# EasyEDA Pro project FKM3.epro, board COMBINED
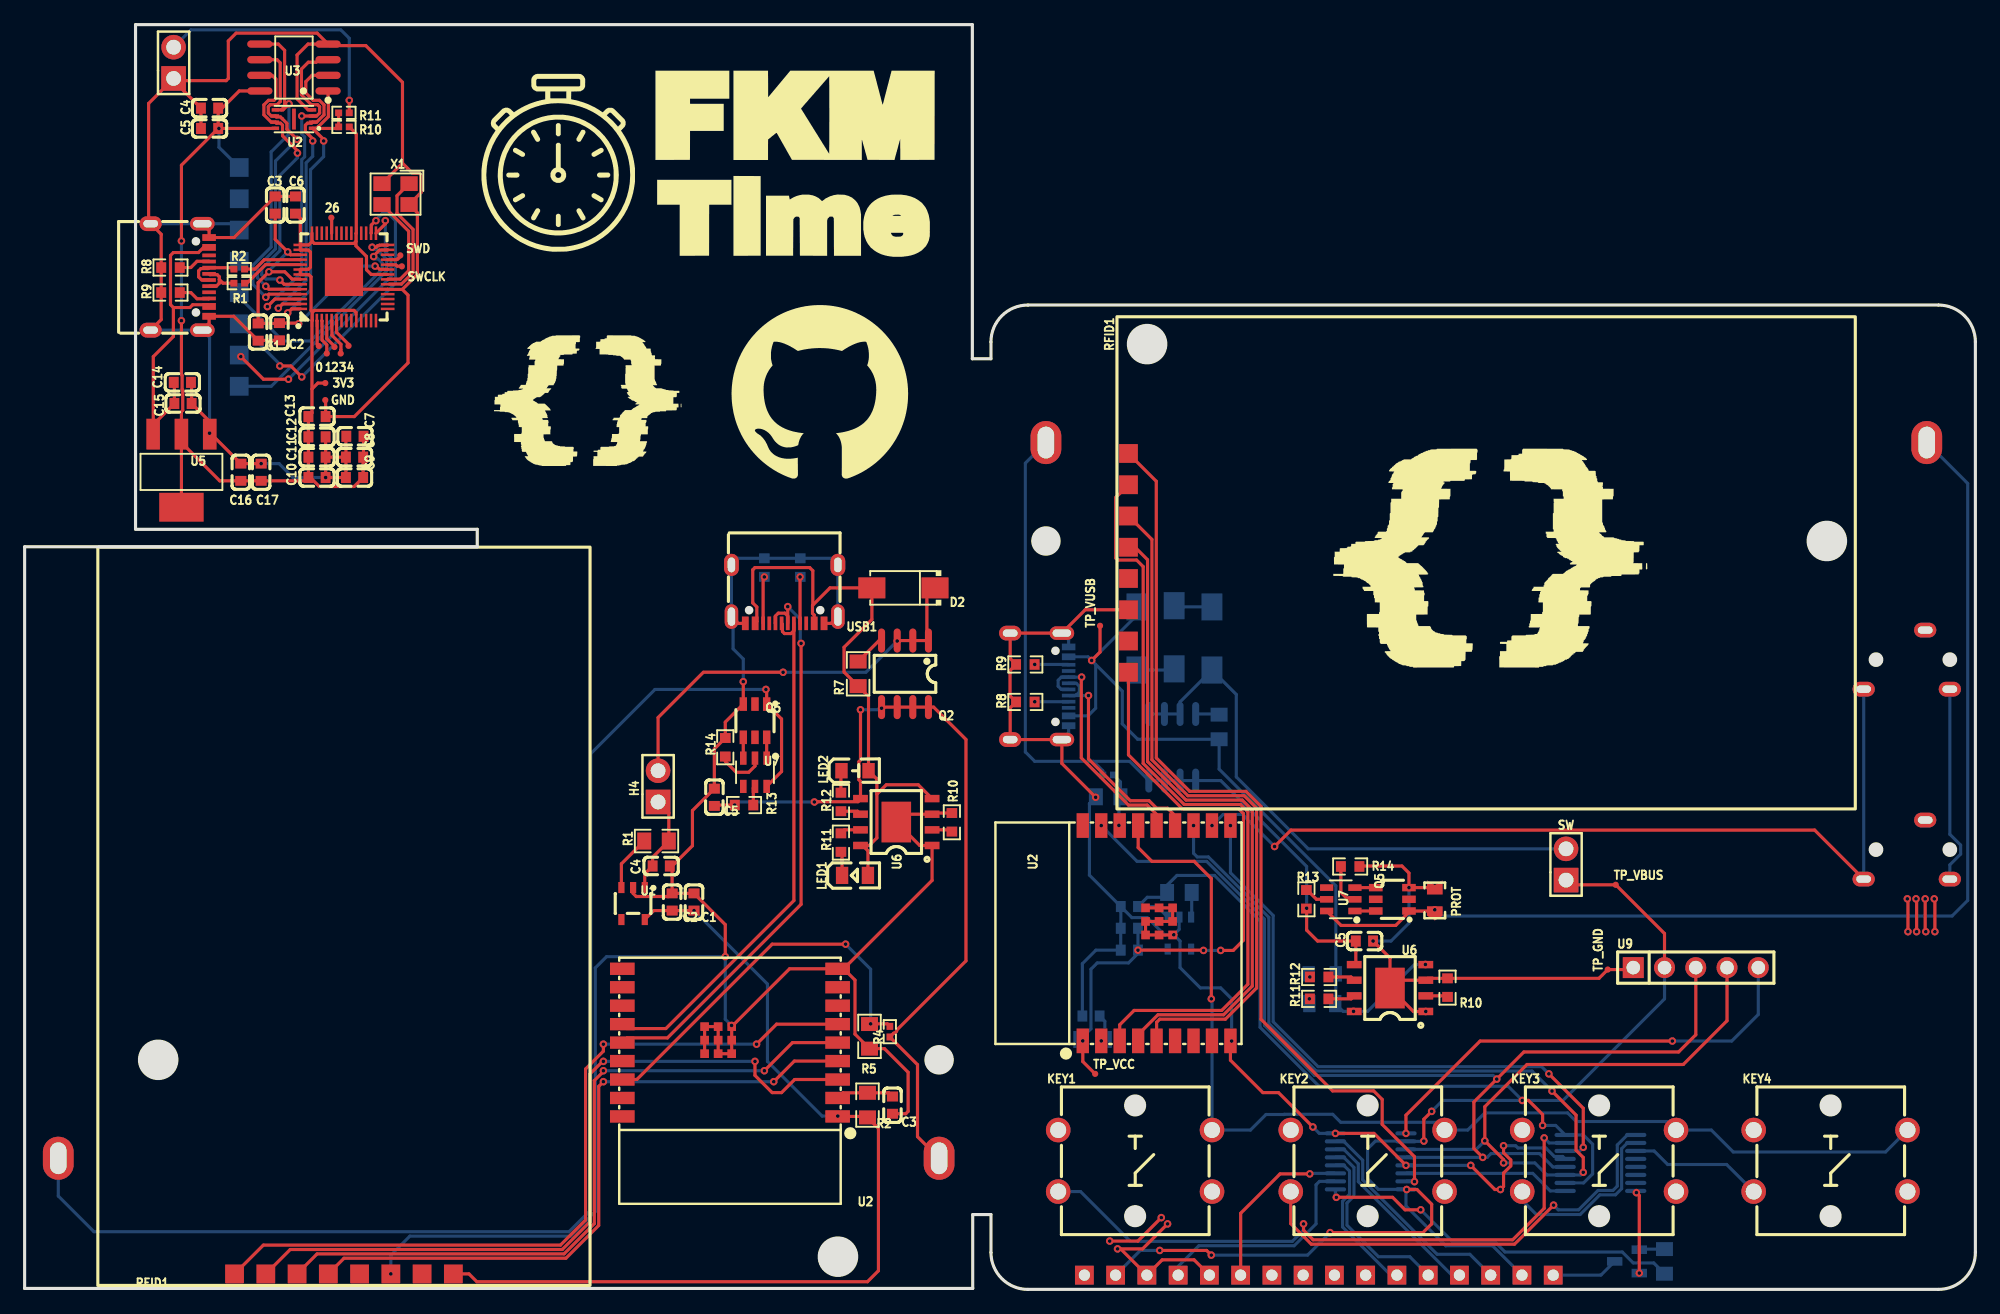
[diagram p7: board, top side]
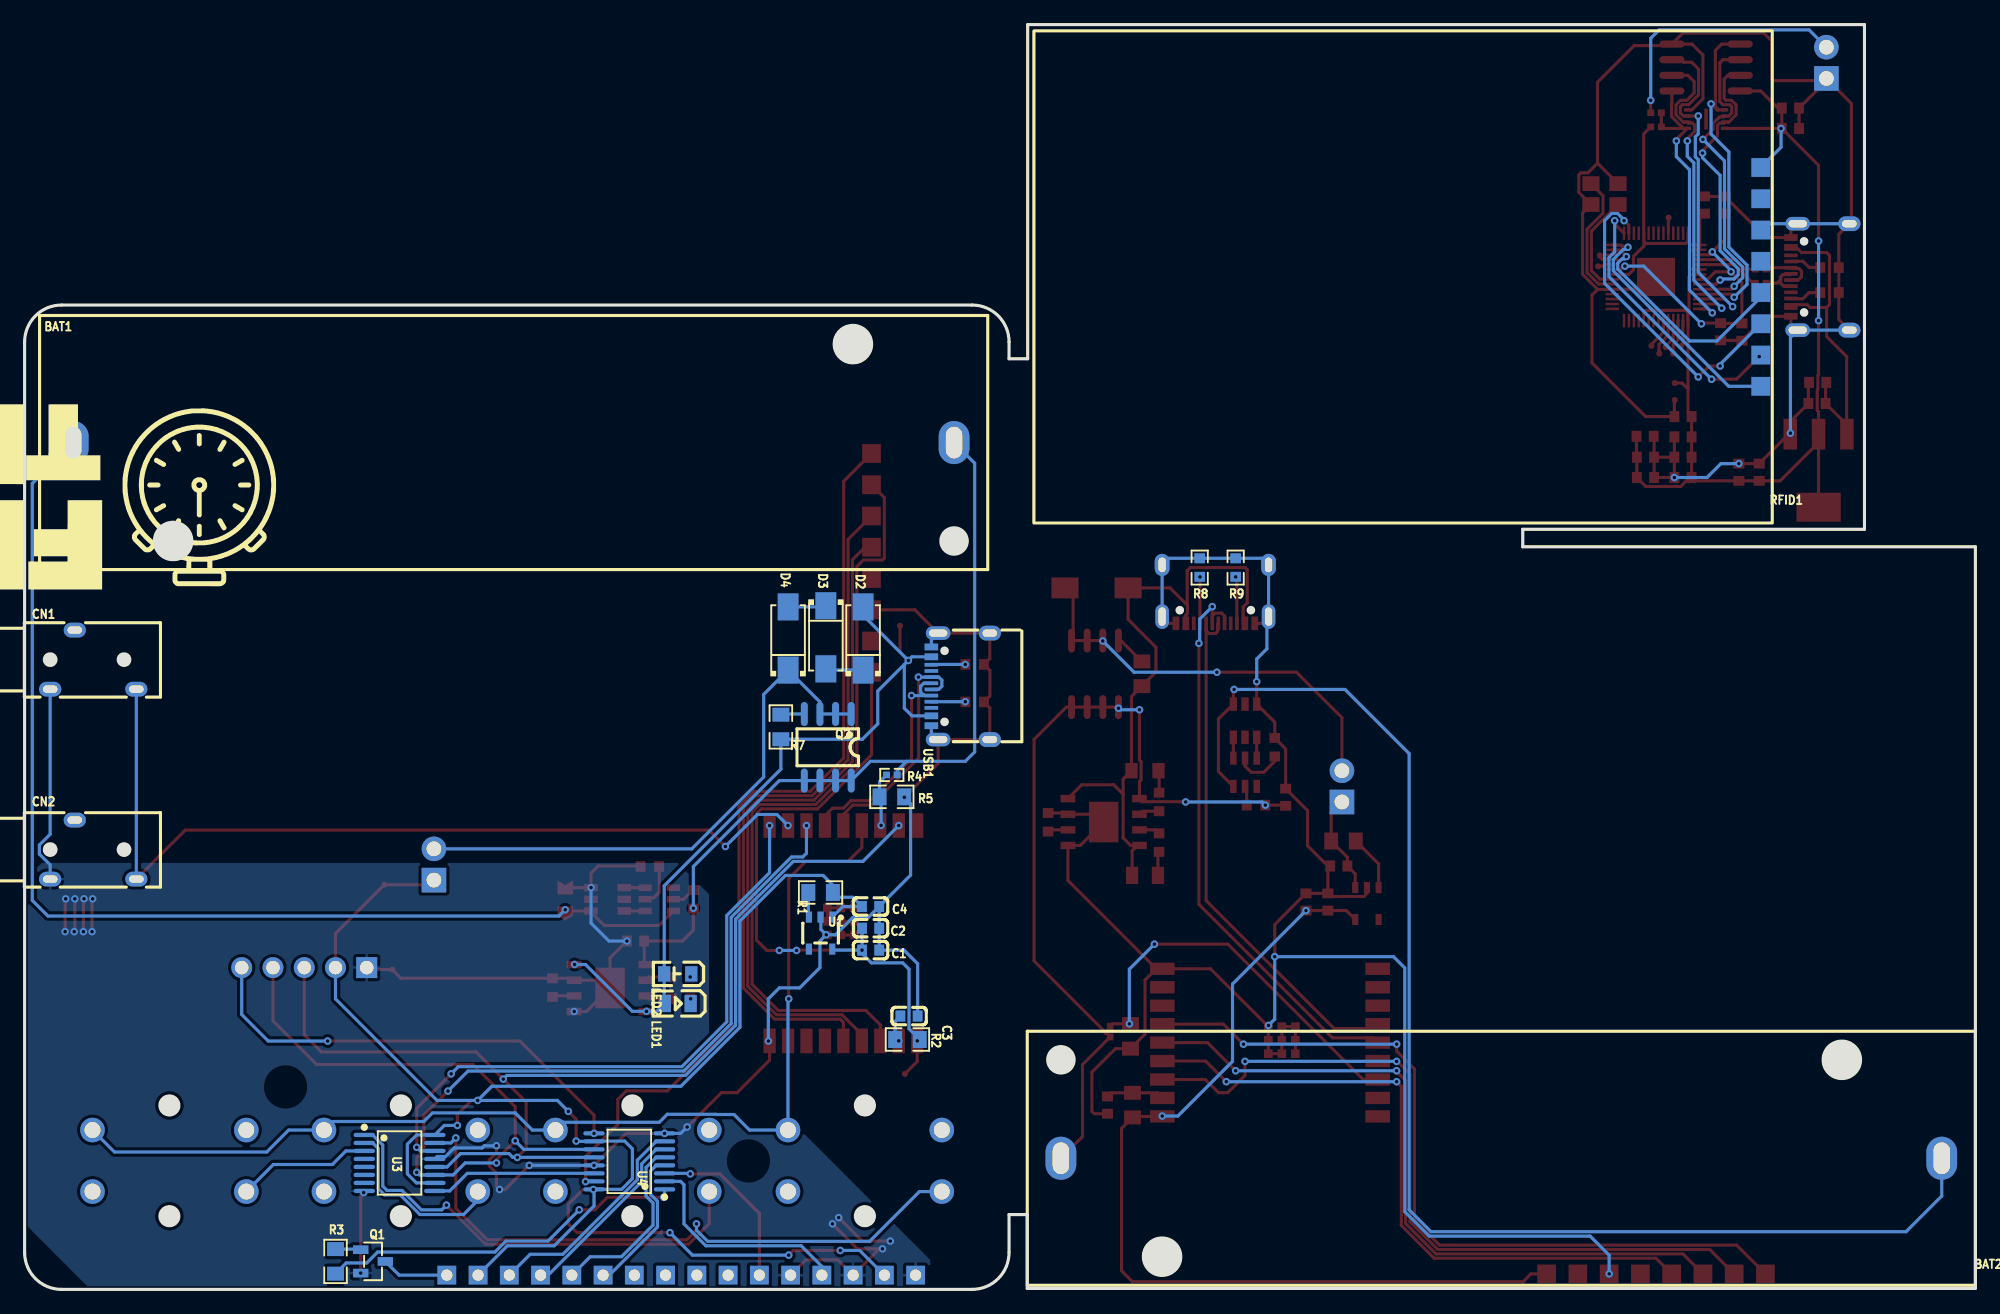
[diagram p8: board, bottom side, seen from below]

Outline 158.53 x 102.79 mm; copper layers: Top Layer, Bottom Layer. Coordinates in mm from the lower left corner of the outline.
Outline path: 0,60.35 36.78,60.35 36.78,61.78 9.01,61.78 9.01,102.79 77.02,102.79 77.02,75.63 78.53,75.63 78.53,77 arc(79.41,79.12) 81.53,80 155.53,80 arc(157.65,79.12) 158.53,77 158.53,3 arc(157.65,0.88) 155.53,0 81.53,0 arc(79.41,0.88) 78.53,3 78.53,6.08 77.05,6.08 77.05,0.08 0,0.08 0,60.35
Stack: Top Layer 0.035mm / Dielectric1 1.51mm FR4 er 4.5 / Bottom Layer 0.035mm

## Design rules (mm)
template: JLCPCB Capability(Two Layers Board)
spacing copperThickness1oz (default): track to track 0.102, other pairs 0.152 to 0.3
spacing copperThickness2oz: track to track 0.203, other pairs 0.152 to 0.3
track width copperThickness1oz (default): min 0.127, default 0.254, max 2.54
track width copperThickness2oz: min 0.203, default 0.254, max 2.54
differential pair differentialPair (default): width min 0.127, default 0.254, max 2.54; gap min 0.152, default 0.152
via viaSize (default): diameter min 0.5, default 0.61, max 10; hole min 0.3, default 0.305, max 6.3

## Placement (name value [footprint] x y rotation side)
0  -  [Test-Point-0.5mm]  23.91 76.67 0 top
1  -  [Test-Point-0.5mm]  24.55 76.06 0 top
2  -  [Test-Point-0.5mm]  25.18 76.59 0 top
3  -  [Test-Point-0.5mm]  25.69 76.06 0 top
3V3  -  [Test-Point-0.5mm]  24.43 73.66 0 top
4  -  [Test-Point-0.5mm]  26.32 76.68 0 top
26  -  [Test-Point-0.5mm]  24.92 87.1 0 top
BAT1  BH-18650-A6AJ003  [BAT-TH_BH-18650-A5BJ003]  118.79 68.82 180 bottom
BAT2  BH-18650-A6AJ003  [BAT-TH_BH-18650-A5BJ003]  38.52 10.66 0 bottom
C1  -  [C0603]  54.4 31.49 90 top
C1#2  -  [C0603]  18.98 77.8 270 top
C1#3  -  [C0603]  89.78 27.57 180 bottom
C2  -  [C0603]  52.62 31.49 90 top
C2#2  -  [C0603]  20.71 77.83 270 top
C2#3  -  [C0603]  89.78 29.35 180 bottom
C3  -  [C0603]  70.53 14.98 90 top
C3#2  -  [C0603]  20.36 88.13 90 top
C3#3  -  [C0603]  86.66 22.22 0 bottom
C4  -  [C0603]  51.73 34.41 0 top
C4#2  -  [C0603]  15.03 96 0 top
C4#3  -  [C0603]  89.78 31.12 180 bottom
C5  -  [C0603]  56.05 40 270 top
C5#2  -  [C0603]  108.88 28.31 180 top
C5#3  -  [C0603]  15.03 94.35 0 top
C6  1uF  [C0603]  22.02 88.13 270 top
C7  100nF  [C0603]  26.84 69.33 180 top
C8  100nF  [C0603]  26.81 67.63 180 top
C9  100nF  [C0603]  26.81 65.98 180 top
C10  100nF  [C0603]  23.76 65.98 0 top
C11  100nF  [C0603]  23.76 67.63 0 top
C12  100nF  [C0603]  23.76 69.28 0 top
C13  100nF  [C0603]  23.76 70.94 0 top
C14  100nF  [C0603]  12.82 73.72 180 top
C15  10uF  [C0603]  12.87 72 180 top
C16  100nF  [C0603]  17.57 66.41 270 top
C17  10uF  [C0603]  19.22 66.41 270 top
CN1  PJ-3200  [AUDIO-TH_PJ-3200]  152.95 51.18 180 bottom
CN2  PJ-3200  [AUDIO-TH_PJ-3200]  152.95 35.74 180 bottom
D2  -  [SMA_L4.2-W2.6-LS5.3-RD]  71.42 57.01 180 top
D2#2  -  [SMA_L4.2-W2.6-LS5.3-RD]  90.39 52.9 90 bottom
D3  SS14  [SMA_L4.2-W2.6-LS5.3-RD]  93.42 53 270 bottom
D4  SS14  [SMA_L4.2-W2.6-LS5.3-RD]  96.49 52.9 90 bottom
GND  -  [Test-Point-0.5mm]  24.43 72.28 0 top
H1  -  [LCD16x2 edge connector]  86.12 1.16 0 top
H1#2  -  [HDR-TH_2P-P2.54-V-M]  12.11 99.69 90 top
H4  PW SWITCH  [HDR-TH_2P-P2.54-V-M]  51.48 40.88 90 top
KEY1  B3F-4055  [KEY-TH_4P-L12.0-W12.0-P5.00-LS13.4-EH]  90.25 10.45 0 top
KEY2  B3F-4055  [KEY-TH_4P-L12.0-W12.0-P5.00-LS13.4-EH]  109.14 10.45 0 top
KEY3  B3F-4055  [KEY-TH_4P-L12.0-W12.0-P5.00-LS13.4-EH]  127.95 10.45 0 top
KEY4  B3F-4055  [KEY-TH_4P-L12.0-W12.0-P5.00-LS13.4-EH]  146.76 10.45 0 top
LED1  -  [LED0805-R-RD]  67.48 33.64 0 top
LED1#2  -  [LED0805-R-RD]  105.45 23.23 0 bottom
LED2  -  [LED0805-RD_BLUE]  67.48 42.15 0 top
LED2#2  -  [LED0805-RD_BLUE]  105.45 25.64 0 bottom
PROT  SOLDERING JUMPER  [JUMPER]  114.6 32.88 90 top
Q1  MMBT3904  [SOT-23-3_L2.9-W1.3-P1.90-LS2.4-BR]  130.22 2.28 0 bottom
Q2  -  [SOIC-8_L5.0-W4.0-P1.27-LS6.0-BL]  71.55 50.03 180 top
Q2#2  -  [SOIC-8_L5.0-W4.0-P1.27-LS6.0-BL]  93.26 44.06 0 bottom
Q5  -  [SOT-23-6_L2.9-W1.6-P0.95-LS2.8-BR]  59.35 46.22 90 top
Q5#2  -  [SOT-23-6_L2.9-W1.6-P0.95-LS2.8-BR]  111.15 31.7 0 top
R1  -  [R0402]  17.44 81.78 180 top
R1#2  -  [R0805]  51.35 36.44 0 top
R1#3  -  [R0805]  93.84 32.26 180 bottom
R2  -  [R0402]  17.44 82.92 180 top
R2#2  -  [R0805]  68.5 14.98 90 top
R2#3  -  [R0805]  86.79 20.31 0 bottom
R3  10kΩ  [R0805]  133.26 2.28 90 bottom
R4  -  [R0402]  70.31 20.94 90 top
R4#2  -  [R0402]  88.05 41.81 0 bottom
R5  -  [R0805]  68.66 20.56 270 top
R5#2  -  [R0805]  88.05 40.03 180 bottom
R7  -  [R0805]  67.73 50.03 90 top
R7#2  -  [R0805]  97.07 45.71 90 bottom
R8  -  [R0603]  81.32 47.74 0 top
R8#2  -  [R0603]  11.85 83.05 0 top
R8#3  -  [R0603]  63.04 58.66 270 bottom
R9  -  [R0603]  81.32 50.79 0 top
R9#2  -  [R0603]  11.85 81.02 0 top
R9#3  -  [R0603]  60.11 58.66 270 bottom
R10  -  [R0402]  25.95 94.48 0 top
R10#2  -  [R0603]  75.36 37.96 90 top
R10#3  -  [R0603]  115.63 24.53 90 top
R11  -  [R0402]  25.95 95.62 180 top
R11#2  -  [R0603]  66.34 36.31 90 top
R11#3  -  [R0603]  105.2 23.61 0 top
R12  -  [R0603]  66.34 39.61 270 top
R12#2  -  [R0603]  105.2 25.39 0 top
R13  -  [R0603]  58.46 39.36 180 top
R13#2  -  [R0603]  104.16 31.7 270 top
R14  -  [R0603]  56.94 44.06 270 top
R14#2  -  [R0603]  107.72 34.37 180 top
RFID1  -  [RFID-RC522-Board]  64.43 5.58 90 top
RFID1#2  -  [RFID-RC522-Board]  94.02 20.56 0 top
RFID1#3  -  [RFID-RC522-Board]  21.76 120.77 0 bottom
SW  PW SWITCH  [HDR-TH_2P-P2.54-V-M]  125.27 34.53 90 top
SWCLK  -  [Test-Point-0.5mm]  30.66 83.14 0 top
SWD  -  [Test-Point-0.5mm]  30.53 84.03 0 top
TP_GND  -  [Test-Point-0.5mm]  128.65 25.99 90 top
TP_VBUS  -  [Test-Point-0.5mm]  129.3 32.88 0 top
TP_VCC  -  [Test-Point-0.5mm]  87 17.52 0 top
TP_VUSB  -  [Test-Point-0.5mm]  87.39 53.93 90 top
U1  -  [SOT-25_L3.0-W1.6-P0.95-LS2.8-BL]  49.45 31.36 180 top
U1#2  -  [LQFN-56_L7.0-W7.0-P0.4-EP]  25.95 82.29 90 top
U1#3  -  [SOT-25_L3.0-W1.6-P0.95-LS2.8-BL]  93.84 28.96 0 bottom
U2  -  [USON-8_L3.0-W2.0-P0.50-BL-EP]  21.89 95.11 90 top
U2#2  -  [BULETM-SMD_ESPRESSIF_ESP32-C3-WROOM-02-N4-4MB]  57.32 20.06 180 top
U2#3  -  [BULETM-SMD_ESPRESSIF_ESP32-C3-WROOM-02-N4-4MB]  91.99 28.95 90 top
U3  -  [SOIC-8_L4.9-W3.9-P1.27-LS6.0-BL]  21.89 99.3 90 top
U3#2  -  [TSSOP-16_L5.0-W4.4-P0.65-LS6.4-BL]  128.06 10.28 270 bottom
U4  74HC595PW,118  [TSSOP-16_L5.0-W4.4-P0.65-LS6.4-BL]  109.39 10.4 90 bottom
U5  AMS1117-3.3  [SOT-223-3_L6.5-W3.4-P2.30-LS7.0-BR]  12.74 66.54 90 top
U6  -  [ESOP-8_L4.9-W3.9-P1.27-LS6.0-BL-EP]  70.84 37.98 90 top
U6#2  -  [ESOP-8_L4.9-W3.9-P1.27-LS6.0-BL-EP]  110.96 24.49 90 top
U7  -  [SOT-23-6_L2.9-W1.6-P0.95-LS2.8-BL]  59.35 42.03 180 top
U7#2  -  [SOT-23-6_L2.9-W1.6-P0.95-LS2.8-BL]  106.96 31.7 90 top
U9  HB-PH3-25415PB2GOP  [HDR-TH_5P-P2.54-V-M]  135.81 26.15 0 top
USB1  -  [USB-C-SMD_TYPE-C-6PIN-2MD-073]  61.77 56.51 180 top
USB1#2  -  [USB-C-SMD_TYPE-C-6PIN-2MD-073]  12.62 82.29 270 top
USB1#3  -  [USB-C-SMD_TYPE-C-6PIN-2MD-073]  82.47 49.01 90 bottom
X1  12MHz  [CRYSTAL-SMD_4P-L3.2-W2.5-BL]  30.14 89.02 180 top

## Footprints (pads in the part's own frame, mm; a bottom-side part is the same pattern mirrored in y, then rotated)
AUDIO-TH_PJ-3200
  oval 1.8x1.2 hole 1.2x0.6: 2(-1.5,2.4) 3(-3.5,-2.4) 4(3.5,-2.4)
BAT-TH_BH-18650-A5BJ003
  oval 2.5x3.5 hole 1.34x2.58: 1(-35.79,0) 2(35.79,0)
BULETM-SMD_ESPRESSIF_ESP32-C3-WROOM-02-N4-4MB
  rect 2x1 smd: 1(-8.75,6) 2(-8.75,4.5) 3(-8.75,3) 4(-8.75,1.5) 5(-8.75,0) 6(-8.75,-1.5) 7(-8.75,-3) 8(-8.75,-4.5) 9(-8.75,-6) 10(8.75,-6) 11(8.75,-4.5) 12(8.75,-3) 13(8.75,-1.5) 14(8.75,0) 15(8.75,1.5) 16(8.75,3) 17(8.75,4.5) 18(8.75,6)
  rect 0.7x0.7 smd: 19(-0.14,0.9) 19(-0.14,-0.2) 19(-0.14,-1.3) 19(0.96,0.9) 19(0.96,-0.2) 19(0.96,-1.3) 19(2.06,0.9) 19(2.06,-0.2) 19(2.06,-1.3)
C0603
  rect 0.8x0.9 smd: 1(-0.7,0) 2(0.7,0)
CRYSTAL-SMD_4P-L3.2-W2.5-BL
  rect 1.4x1.2 smd: 1(-1.1,-0.85) 2(1.1,-0.85) 3(1.1,0.85) 4(-1.1,0.85)
ESOP-8_L4.9-W3.9-P1.27-LS6.0-BL-EP
  rect 0.6x1.2 smd: 1(-1.905,-2.909) 2(-0.635,-2.909) 3(0.635,-2.909) 4(1.905,-2.909) 5(1.905,2.909) 6(0.635,2.909) 7(-0.635,2.909) 8(-1.905,2.909)
  rect 3.3x2.4 smd: 9(0,0)
HDR-TH_2P-P2.54-V-M
  rect 2x2 hole 1.2: 1(-1.27,0)
  round 2 hole 1.2: 2(1.27,0)
HDR-TH_5P-P2.54-V-M
  rect 1.7x1.7 hole 1.1: 1(-5.08,0)
  round 1.7 hole 1.1: 2(-2.54,0) 3(0,0) 4(2.54,0) 5(5.08,0)
JUMPER
  custom 1.143x1.27 smd: 1(-2.134,0) 2(-0.406,0)
KEY-TH_4P-L12.0-W12.0-P5.00-LS13.4-EH
  round 2 hole 1.3: 1(6.25,-2.5) 2(-6.25,-2.5) 3(6.25,2.5) 4(-6.25,2.5)
LCD16x2 edge connector
  rect 1.524x1.524 hole 0.914x0.914: 1(0,0) 3(5.08,0) 4(7.62,0) 5(10.16,0) 6(12.7,0) 7(15.24,0) 8(17.78,0) 9(20.32,0) 10(22.86,0) 11(25.4,0) 12(27.94,0) 13(30.48,0) 14(33.02,0) 15(35.56,0) 16(38.1,0)
  rect 1.524x1.524 hole 0.914x1: 2(2.54,0)
LED0805-R-RD
  rect 1x1.399 smd: 1(1.05,0) 2(-1.05,0)
LED0805-RD_BLUE
  rect 1x1.25 smd: 1(-1.1,0) 2(1.1,0)
LQFN-56_L7.0-W7.0-P0.4-EP
  rect 1.1x0.2 smd: 1(-3.55,2.6) 2(-3.55,2.2) 3(-3.55,1.8) 4(-3.55,1.4) 5(-3.55,1) 6(-3.55,0.6) 7(-3.55,0.2) 8(-3.55,-0.2) 9(-3.55,-0.6) 10(-3.55,-1) 11(-3.55,-1.4) 12(-3.55,-1.8) 13(-3.55,-2.2) 14(-3.55,-2.6) 29(3.55,-2.6) 30(3.55,-2.2) 31(3.55,-1.8) 32(3.55,-1.4) 33(3.55,-1) 34(3.55,-0.6) 35(3.55,-0.2) 36(3.55,0.2) 37(3.55,0.6) 38(3.55,1) 39(3.55,1.4) 40(3.55,1.8) 41(3.55,2.2) 42(3.55,2.6)
  rect 0.2x1.1 smd: 15(-2.6,-3.55) 16(-2.2,-3.55) 17(-1.8,-3.55) 18(-1.4,-3.55) 19(-1,-3.55) 20(-0.6,-3.55) 21(-0.2,-3.55) 22(0.2,-3.55) 23(0.6,-3.55) 24(1,-3.55) 25(1.4,-3.55) 26(1.8,-3.55) 27(2.2,-3.55) 28(2.6,-3.55) 43(2.6,3.55) 44(2.2,3.55) 45(1.8,3.55) 46(1.4,3.55) 47(1,3.55) 48(0.6,3.55) 49(0.2,3.55) 50(-0.2,3.55) 51(-0.6,3.55) 52(-1,3.55) 53(-1.4,3.55) 54(-1.8,3.55) 55(-2.2,3.55) 56(-2.6,3.55)
  rect 3.1x3.1 smd: 57(0,0)
R0402
  rect 0.566x0.54 smd: 1(-0.433,0) 2(0.433,0)
R0603
  rect 0.806x0.864 smd: 1(-0.753,0) 2(0.753,0)
R0805
  rect 1.133x1.377 smd: 1(-1,0) 2(1,0)
RFID-RC522-Board
  rect 1.524x1.524 smd: 1(-4.318,47.371) 2(-4.318,44.831) 3(-4.318,42.291) 4(-4.318,39.751) 5(-4.318,37.211) 6(-4.318,34.671) 7(-4.318,32.131) 8(-4.318,29.591)
SMA_L4.2-W2.6-LS5.3-RD
  rect 2.2x1.7 smd: 1(-2.566,0) 2(2.566,0)
SOIC-8_L4.9-W3.9-P1.27-LS6.0-BL
  oval 0.588x2.045 smd: 1(-1.905,-2.772) 2(-0.635,-2.772) 3(0.635,-2.772) 4(1.905,-2.772) 5(1.905,2.772) 6(0.635,2.772) 7(-0.635,2.772) 8(-1.905,2.772)
SOIC-8_L5.0-W4.0-P1.27-LS6.0-BL
  oval 0.569x1.95 smd: 1(-1.905,-2.705) 2(-0.635,-2.705) 3(0.635,-2.705) 4(1.905,-2.705) 5(1.905,2.705) 6(0.635,2.705) 7(-0.635,2.705) 8(-1.905,2.705)
SOT-23-3_L2.9-W1.3-P1.90-LS2.4-BR
  rect 1.25x0.7 smd: 1(1,-0.95) 2(1,0.95) 3(-1,0)
SOT-23-6_L2.9-W1.6-P0.95-LS2.8-BL
  rect 0.532x1.072 smd: 1(-0.95,-1.149) 2(0,-1.149) 3(0.95,-1.149) 4(0.95,1.149) 5(0,1.149) 6(-0.95,1.149)
SOT-23-6_L2.9-W1.6-P0.95-LS2.8-BR
  rect 1.1x0.6 smd: 1(1.35,-0.95) 2(1.35,0) 3(1.35,0.95) 4(-1.35,0.95) 5(-1.35,0) 6(-1.35,-0.95)
SOT-25_L3.0-W1.6-P0.95-LS2.8-BL
  rect 0.5x0.9 smd: 1(-0.95,-1.3) 2(0,-1.3) 3(0.95,-1.3) 4(0.95,1.3) 5(-0.95,1.3)
SOT-223-3_L6.5-W3.4-P2.30-LS7.0-BR
  rect 2.5x1.1 smd: 1(2.97,-2.3) 2(2.97,0) 3(2.97,2.3)
  rect 2.34x3.6 smd: 4(-2.97,0)
Test-Point-0.5mm
  round 0.5 smd: 1(0,0)
TSSOP-16_L5.0-W4.4-P0.65-LS6.4-BL
  oval 0.343x1.732 smd: 1(-2.275,-2.866) 2(-1.625,-2.866) 3(-0.975,-2.866) 4(-0.325,-2.866) 5(0.325,-2.866) 6(0.975,-2.866) 7(1.625,-2.866) 8(2.275,-2.866) 9(2.275,2.866) 10(1.625,2.866) 11(0.975,2.866) 12(0.325,2.866) 13(-0.325,2.866) 14(-0.975,2.866) 15(-1.625,2.866) 16(-2.275,2.866)
USB-C-SMD_TYPE-C-6PIN-2MD-073
  rect 0.55x1.1 smd: 1(-3.2,2.375) 2(-2.4,2.375) 11(2.4,2.375) 12(3.2,2.375)
  rect 0.3x1.1 smd: 3(-1.75,2.375) 4(-1.25,2.375) 5(-0.75,2.375) 6(-0.25,2.375) 7(0.25,2.375) 8(0.75,2.375) 9(1.25,2.375) 10(1.75,2.375)
  oval 1.1x2 hole 0.6x1.5: 13(-4.325,1.825) 14(4.325,1.825)
  oval 1.2x1.8 hole 0.6x1.2: 13(-4.325,-2.375) 14(4.325,-2.375)
USON-8_L3.0-W2.0-P0.50-BL-EP
  rect 0.28x0.6 smd: 1(-0.75,-1.508) 2(-0.25,-1.508) 3(0.25,-1.508) 4(0.75,-1.508) 5(0.75,1.508) 6(0.25,1.508) 7(-0.25,1.508) 8(-0.75,1.508)
  rect 1.7x0.3 smd: 9(0,0)

## Nets
+1V1: C1#2.1 C2#2.1 C3#2.1 U1#2.23 U1#2.45 U1#2.50
+3V3: 3V3.1 C4#2.2 C5#3.2 C6.2 C7.1 C8.1 C9.1 C10.1 C11.1 C12.1 C13.1 C16.2 C17.2 R10.2 RFID1#3.8 U1#2.1 U1#2.10 U1#2.22 U1#2.33 U1#2.42 U1#2.43 U1#2.44 U1#2.48 U1#2.49 U2.8 U3.8 U5.2 U5.4
GND: C1.2 C1#2.2 C1#3.2 C2.2 C2#2.2 C2#3.2 C3.1 C3#2.2 C3#3.1 C4.2 C4#2.1 C4#3.2 C5.1 C5#2.1 C5#3.1 C6.1 C7.2 C8.2 C9.2 C10.2 C11.2 C12.2 C13.2 C14.1 C15.1 C16.1 C17.1 CN1.3 CN2.3 GND.1 H1.1 H1.3 H1.5 H1#2.1 PROT.2 Q1.2 Q5.3 Q5#2.3 R5.2 R5#2.2 R8.1 R8#2.1 R8#3.1 R9.1 R9#2.1 R9#3.1 R10#2.2 R10#3.2 R14.1 R14#2.1 RFID1.6 RFID1#2.6 RFID1#3.6 TP_GND.1 U1.2 U1#2.19 U1#2.57 U1#3.2 U2.4 U2#2.9 U2#2.19 U2#3.9 U2#3.19 U3.4 U3#2.8 U3#2.13 U4.8 U4.13 U5.1 U6.1 U6.3 U6.9 U6#2.1 U6#2.3 U6#2.9 U9.1 USB1.1 USB1.12 USB1.13 USB1.14 USB1#2.1 USB1#2.12 USB1#2.13 USB1#2.14 USB1#3.1 USB1#3.12 USB1#3.13 USB1#3.14 X1.2 X1.4
VBUS: C4.1 C4#3.1 H1.2 H1.15 H4.1 R1#2.2 R1#3.2 SW.1 TP_VBUS.1 U1.1 U1#3.1 U3#2.10 U3#2.16 U4.10 U4.16 U9.2
VCC: C1.1 C1#3.1 C2.1 C2#3.1 R2#2.1 R2#3.1 RFID1.8 RFID1#2.8 TP_VCC.1 U1.5 U1#3.5 U2#2.1 U2#3.1
B+: BAT1.2 BAT2.2 C5.2 C5#2.2 Q2.5 Q2.6 Q2.7 Q2.8 Q2#2.5 Q2#2.6 Q2#2.7 Q2#2.8 R4.1 R4#2.1 R13.2 R13#2.2 U6.5 U6#2.5
B-: BAT1.1 BAT2.1 PROT.1 Q5.1 Q5#2.1 U7.6 U7#2.6
BAT_SENS: R4.2 R4#2.2 R5.1 R5#2.1 U2#2.16 U2#3.16
BTN_1: KEY1.2 U3#2.15
BTN_2: KEY2.2 U3#2.1
BTN_3: KEY3.2 U3#2.2
BTN_4: KEY4.2 U3#2.3
BTN_INP: KEY1.3 KEY2.3 KEY3.3 KEY4.3 U2#3.15
GPIO0: 0.1 U1#2.2
GPIO1: 1.1 U1#2.3
GPIO2: 2.1 U1#2.4
GPIO3: 3.1 U1#2.5
GPIO4: 4.1 U1#2.6
GPIO26: 26.1 U1#2.38
IRQ: U1#2.31
JACK: CN1.4 CN2.4 U2#3.11
LCD_BL: R3.1 U4.1
LCD_D4: H1.11 U4.4
LCD_D5: H1.12 U4.5
LCD_D6: H1.13 U4.6
LCD_D7: H1.14 U4.7
LCD_E: H1.6 U4.3
LCD_RS: H1.4 U4.2
QSPI_SCLK: U1#2.52 U2.6 U3.6
QSPI_SD0: U1#2.53 U2.5 U3.5
QSPI_SD1: U1#2.55 U2.2 U3.2
QSPI_SD2: U1#2.54 U2.3 U3.3
QSPI_SD3: U1#2.51 U2.7 U3.7
QSPI_SS: R10.1 R11.2 U1#2.56 U2.1 U3.1
S_DS: U2#3.10 U3#2.14
S_OUT: U4.9 U9.5
S_SHCP: U2#3.12 U3#2.11 U4.11 U9.4
S_STCP: U2#3.17 U3#2.12 U4.12 U9.3
SPI_CS: RFID1.1 RFID1#2.1 RFID1#3.1 U1#2.28 U2#2.6 U4.15
SPI_MISO: RFID1.4 RFID1#2.4 RFID1#3.4 U1#2.27 U2#2.4 U2#3.4
SPI_MOSI: RFID1.3 RFID1#2.3 RFID1#3.3 U1#2.30 U2#2.5 U2#3.5
SPI_SCK: RFID1.2 RFID1#2.2 RFID1#3.2 U1#2.29 U2#2.3 U2#3.3
SWCLK: SWCLK.1 U1#2.24
SWD: SWD.1 U1#2.25
USB_D+: U2#2.14 U2#3.14 USB1.6 USB1.8 USB1#3.6 USB1#3.8
USB_D-: U2#2.13 U2#3.13 USB1.5 USB1.7 USB1#3.5 USB1#3.7
USB_DM: R2.2 USB1#2.5 USB1#2.7
USB_DP: R1.2 USB1#2.6 USB1#2.8
VUSB: C14.2 C15.2 D2.2 D2#2.2 LED1.1 LED1#2.1 LED2.2 LED2#2.2 R7.1 R7#2.1 TP_VUSB.1 U5.3 U6.4 U6.8 U6#2.4 U6#2.8 USB1.2 USB1.11 USB1#2.2 USB1#2.11 USB1#3.2 USB1#3.11
XIN: U1#2.20 X1.1
XOUT: U1#2.21 X1.3
$1N383: R1#3.1 U1#3.3
$1N405: C3.2 R2#2.2 U2#2.2
$1N953: C3#3.2 R2#3.2 U2#3.2
$1N1062: R1.1 U1#2.47
$1N1071: R1#2.1 U1.3
$1N1101: R2.1 U1#2.46
$1N1888: R8#2.2 USB1#2.4
$1N1892: R9#2.2 USB1#2.10
$1N2947: H1#2.2 R11.1
$1N7305: U3#2.9 U4.14
$2N1363: D2.1 H4.2 Q2.1 Q2.2 Q2.3
$2N1368: Q2.4 R7.2
$2N1375: R14.2 U7.2
$2N1376: Q5.4 U7.3
$2N1379: Q5.6 U7.1
$2N1382: R13.1 U7.5
$2N1388: R8#3.2 USB1.4
$2N1391: R9#3.2 USB1.10
$2N1394: R11#2.2 U6.7
$2N1395: R12.2 U6.6
$2N1399: R10#2.1 U6.2
$2N1401: LED2.1 R12.1
$2N1402: LED1.2 R11#2.1
$2N3153: Q1.1 R3.2
$2N3159: H1.16 Q1.3
$3N541: D4.1 Q2#2.1 Q2#2.2 Q2#2.3 SW.2
$3N542: Q2#2.4 R7#2.2
$3N546: D2#2.1 D3.2
$3N547: D3.1 D4.2
$3N796: R9.2 USB1#3.10
$3N800: R8.2 USB1#3.4
$3N1470: R13#2.1 U7#2.5
$3N1480: R11#3.2 U6#2.7
$3N1483: R12#2.2 U6#2.6
$3N1491: R10#3.1 U6#2.2
$3N1585: R14#2.2 U7#2.2
$3N1604: Q5#2.4 U7#2.3
$3N1608: Q5#2.6 U7#2.1
$3N3082: LED1#2.2 R11#3.1
$3N3173: LED2#2.1 R12#2.1

Pads without a net: CN1 2; CN2 2; H1 7 8 9 10; KEY1 1 4; KEY2 1 4; KEY3 1 4; KEY4 1 4; Q5 2 5; Q5#2 2 5; RFID1 5 7; RFID1#2 5 7; RFID1#3 5 7; U1 4; U1#2 7 8 9 11 12 13 14 15 16 17 18 26 32 34 35 36 37 39 40 41; U1#3 4; U2 9; U2#2 7 8 10 11 12 15 17 18; U2#3 6 7 8 18; U3#2 4 5 6 7; U7 4; U7#2 4; USB1 3 9; USB1#2 3 9; USB1#3 3 9

## Via types
v1: diameter 0.61, hole 0.305, Top Layer to Bottom Layer, 132 vias

## Routing (per net, layer and track width the routed paths; a pad name or vN(x,y) marks a point on that pad's centre or on a via; arc(x,y) is an arc through that point)
+1V1: length 26.9
  Top Layer w0.254: C3#2.1 20.36,85.33 v1(21.38,84.32) 21.61,84.09 U1#2.45 ; U1#2.50 22.38,82.11 21.74,82.11 21.14,82.7 v1(19.86,82.7) 18.98,81.82 C1#2.1 20.68,78.5 C2#2.1 22.21,78.53 v1(22.27,78.48) ; U1#2.23 29.48,82.91 28.84,82.91 28.58,83.16 v1(28.48,83.16)
  Bottom Layer w0.254: v1(19.86,82.7) 19.86,82.79 v1(21.38,84.32) ; v1(28.48,83.16) 26.96,83.16 v1(22.27,78.48)
+3V3: length 114.3
  Top Layer w0.254: C6.2 22.4,87.04 U1#2.43 ; v1(15.79,94.35) C5#3.2 12.74,91.37 v1(12.74,85.21) ; v1(15.79,94.35) 20.37,94.35 U2.8 ; v1(15.79,94.35) 15.73,94.41 C4#2.2 16.05,96 17.44,97.4 U3.8 ; 23.35,85.15 23.09,84.89 U1#2.43 ; 23.35,85.15 U1#2.42 ; 23.35,85.15 23.4,85.15 23.54,85.01 26.77,85.01 26.93,85.17 ; 23.41,79.44 23.37,79.4 23.37,78.76 U1#2.1 23.35,73.18 ; 23.41,79.44 23.28,79.58 23.28,82.29 23.11,82.47 22.42,82.47 U1#2.49 U1#2.48 22.42,82.91 23.07,82.91 23.23,83.07 23.23,84.3 23.07,84.47 22.42,84.47 U1#2.44 U1#2.43 ; 23.41,79.44 23.54,79.56 26.77,79.56 26.93,79.4 26.93,79.24 ; U5.2 12.74,71.33 12.85,71.43 12.85,73.1 12.8,73.15 12.8,74.28 12.74,74.33 v1(12.74,78.73) ; 26.38,94.48 26.95,93.91 U1#2.33 26.93,85.82 26.93,85.17 ; C7.1 27.54,67.66 C8.1 C9.1 26.78,65.25 23.95,65.25 23.22,65.98 23.06,65.98 ; 23.35,73.18 23.83,73.66 3V3.1 ; 23.35,73.18 23.35,71.22 23.06,70.94 23.06,65.98 ; 26.93,85.17 26.93,84.8 27.78,83.95 27.78,82.87 28.16,82.49 U1#2.22 ; U5.4 12.74,68.82 15.86,65.71 C16.2 C17.2 22.79,65.71 23.06,65.98
  Bottom Layer w0.254: RFID1#3.8 15.79,92.83 v1(15.79,94.35) ; v1(12.74,85.21) v1(12.74,78.73)
GND: length 549.7
  Top Layer w0.254: v1(88.18,3.93) 90.47,3.93 v1(92.37,5.83) ; U1#2.57 26.95,81.29 U1#2.19 29.52,81.27 30.69,81.27 ; v1(153.7,31.74) 153.75,31.69 v1(153.75,29.07) ; U2#3.19 U2#3.19 U2#3.19 91.09,29.91 93.29,29.91 U2#3.19 U2#3.19 U2#3.19 ; v1(109.58,28.31) 110.96,26.94 U6#2.9 ; v1(130.98,7.86) 131.22,7.63 v1(131.22,1.33) ; U3.4 23.77,102.1 17.19,102.1 16.55,101.46 16.55,98.42 16.37,98.24 12.29,98.24 H1#2.1 ; U3.4 23.03,101.21 22.14,100.32 22.14,96.76 23.04,95.86 U2.4 ; U3.4 24.79,101.08 27.73,101.08 30.71,98.11 30.71,91.53 ; 30.69,81.27 31.92,82.5 31.92,87.49 X1.4 31.24,88.17 32.22,89.15 32.22,90.58 32.06,90.75 31.49,90.75 30.71,91.53 ; 30.69,81.27 31.16,80.8 31.16,75.3 26.79,70.94 C13.2 24.46,72.31 GND.1 ; H1#2.1 10.08,96.38 10.08,86.78 USB1#2.13 11.1,85.75 R8#2.1 R9#2.1 11.1,78.82 USB1#2.14 ; H1#2.1 12.11,98.22 C4#2.1 C5#3.1 ; C2.2 52.37,31.93 49.7,31.93 49.45,32.18 U1.2 ; C2.2 C1.2 56.94,29.65 v1(56.94,27.04) ; C2.2 52.62,34.22 C4.2 52.62,34.41 54.27,36.06 54.27,38.92 C5.1 56.05,43.92 R14.1 56.94,46.11 Q5.3 v1(58.4,49.39) ; v1(92.88,5.32) 90.85,3.29 89.07,3.29 ; C8.2 26.11,69.27 26.09,69.28 C7.2 ; C8.2 C11.2 ; C8.2 C9.2 24.71,65.98 24.46,66.23 C11.2 ; U6#2.9 112.86,22.59 v1(113.87,22.59) ; U6#2.9 111.59,25.13 U6#2.3 114.02,25.28 R10#3.2 127.94,25.28 TP_GND.1 130.57,25.99 U9.1 ; X1.2 30.71,91.53 ; C14.1 13.57,73.66 C15.1 15.04,70.53 U5.1 15.17,69.51 C16.1 v1(19.22,67.11) ; U2#2.19 U2#2.19 55.26,21.36 56.36,21.36 56.36,19.16 U2#2.19 U2#2.19 57.46,21.36 62.16,26.06 U2#2.9 66.56,26.06 ; v1(154.45,31.74) 154.45,29.12 v1(154.5,29.07) ; v1(117.52,10.08) 119.48,8.12 v1(119.93,8.12) 120.19,8.37 120.19,9.45 120.77,10.03 120.77,10.52 120.19,11.1 v1(120.19,11.67) ; v1(153.05,29.07) 153.05,31.69 v1(153,31.74) ; R10#2.2 73.84,38.72 73.74,38.62 71.47,38.62 U6.9 72.74,36.08 73.74,36.08 73.74,33.24 66.56,26.06 ; H1.5 95.04,2.4 92.45,2.4 H1.3 89.07,3.29 ; v1(87.04,40) 84.29,42.74 USB1#3.13 USB1#3.13 80.09,47.26 R8.1 80.08,48.23 80.08,50.3 R9.1 80.09,51.27 USB1#3.14 USB1#3.14 86.19,55.23 RFID1#2.6 ; v1(155.19,31.74) 155.24,31.69 v1(155.24,29.07) ; v1(112.26,10.08) 109.66,12.68 v1(106.52,12.68) ; 108.47,34.37 108.51,34.41 111.93,34.41 112.5,33.84 v1(112.5,32.65) 114.42,32.65 PROT.2 ; v1(104.69,13.2) 101.9,15.99 100.63,15.99 97.99,18.63 U2#3.9 ; 66.56,26.06 67.48,25.14 67.48,20.74 R5.2 69.88,19.56 71.8,17.64 71.8,14.47 71.61,14.28 C3.1 ; USB1#2.14 14.99,78.51 USB1#2.12 17,79.09 C1#2.2 19,77.13 C2#2.2 ; C11.2 C12.2 ; 89.07,3.29 v1(88.82,3.29) ; USB1.1 65.54,54.13 USB1.13 ; USB1#2.13 14.99,86.06 USB1#2.1 17.02,85.49 C3#2.2 C6.1 ; USB1.12 57.99,54.13 USB1.14
  Bottom Layer w0.254: CN2.3 156.45,34.5 157.33,35.38 157.33,36.11 156.45,36.99 CN1.3 ; USB1#3.13 84.84,45.24 USB1#3.1 ; USB1#3.14 84.84,52.79 USB1#3.12 ; v1(112.5,32.65) 112.5,29.77 111.04,28.31 v1(109.58,28.31) ; C4#3.2 86.53,33.67 86.53,39.49 v1(87.04,40) ; C4#3.2 89.98,30.22 91.23,30.22 92.63,28.82 v1(93.39,28.82) ; C4#3.2 89.08,29.35 C2#3.2 C1#3.2 87.06,27.57 85.96,26.47 C3#3.1 ; v1(57.45,21.45) 56.94,21.96 v1(56.94,27.04) 47.29,27.04 46.37,26.13 46.37,6.32 44.39,4.33 31.31,4.33 29.76,2.78 v1(29.76,1.26) ; v1(120.19,11.67) 121.17,11.67 121.35,11.5 123.62,11.5 124.31,10.8 124.99,10.8 U3#2.13 ; v1(15.03,69.59) 15.03,77.37 USB1#2.14 USB1#2.14 ; v1(58.4,49.39) 58.4,51.23 57.58,52.06 57.58,54.55 USB1.14 USB1.14 57.98,59.42 R9#3.1 R8#3.1 65.55,59.42 USB1.13 USB1.13 ; U1#3.2 93.82,30.23 93.82,29.25 v1(93.39,28.82) ; RFID1#3.6 16.93,86.61 USB1#2.13 USB1#2.13 ; v1(93.39,28.82) 93.9,28.31 93.9,26.15 95.55,24.5 97.2,24.5 98.09,23.61 v1(98.09,20.18) ; v1(19.22,67.11) 20.68,67.11 21.81,65.98 v1(24.46,65.98) ; v1(106.52,12.68) 105.21,12.68 v1(104.69,13.2) ; v1(112.26,10.08) v1(117.52,10.08)
VBUS: length 165
  Top Layer w0.254: U9.2 133.27,28.92 TP_VBUS.1 125.65,32.88 SW.1 ; v1(106.09,4.61) 113.63,4.61 114.34,5.32 114.34,6.92 113.15,8.12 v1(112.31,8.12) ; v1(113.71,12.06) 113.71,13.83 v1(114.34,14.47) ; v1(92.25,3.16) 96.06,3.16 v1(96.44,2.78) ; 50.4,32.66 50.4,33.77 C4.1 51.03,35.12 R1#2.2 52.35,38.74 H4.1 ; v1(123.36,13.33) 123.36,14.21 122.22,15.36 v1(121.71,15.36)
  Bottom Layer w0.254: H1.15 119.29,3.55 115.49,3.55 112.26,6.78 112.26,8.13 110.02,8.13 109.14,9.01 109.14,11.42 109.77,12.06 112.23,12.06 112.26,12.03 113.68,12.03 v1(113.71,12.06) ; v1(114.34,14.47) 115.23,15.36 v1(121.71,15.36) ; v1(96.44,2.78) 104.26,2.78 v1(106.09,4.61) ; U1#3.1 92.04,31.12 C4#3.1 91.23,31.87 92.45,31.87 R1#3.2 92.84,32.85 93.64,33.64 96.7,33.64 100.4,29.94 100.4,21.31 105.2,16.51 120.56,16.51 v1(121.71,15.36) ; v1(121.71,15.36) 125.01,15.36 133.27,23.61 U9.2 ; v1(123.36,13.33) 124.42,13.33 125.19,12.55 126.67,12.55 127.42,11.8 127.42,9.39 126.69,8.65 U3#2.10 ; H1.2 90.67,3.16 v1(92.25,3.16)
VCC: length 132.3
  Top Layer w0.254: v1(85.99,20.2) 85.99,18.52 TP_VCC.1 ; v1(95.8,27.55) 95.78,27.57 v1(90.48,27.57) ; 50.4,30.06 51.12,30.79 C2.1 v1(54.4,30.79) ; v1(97.2,27.55) 98.21,27.55 99.05,28.39 99.05,38.66 98.66,39.05 94.09,39.05 89.71,43.44 RFID1#2.8 ; U2#2.1 68.42,14.06 R2#2.1 69.39,13.09 69.39,1.51 68.5,0.62 36.75,0.62 36.11,1.26 RFID1.8
  Bottom Layer w0.254: v1(90.48,27.57) 92.81,27.57 U1#3.5 ; v1(90.48,27.57) C2#3.1 ; v1(90.48,27.57) 90.48,27.3 89.71,26.53 87.17,26.53 86.66,26.03 86.66,21.18 R2#3.1 ; v1(54.4,30.79) 60.37,24.82 60.37,18.53 64.81,14.09 v1(66.08,14.09) ; v1(95.8,27.55) v1(97.2,27.55)
B+: length 133
  Top Layer w0.254: U6#2.5 108.18,26.53 C5#2.2 105.07,28.31 104.18,29.2 v1(104.18,30.98) ; BAT2.2 72.56,12.41 72.56,18.26 R4.1 70.62,20.82 70.7,20.82 70.86,20.98 70.86,21.06 76.5,26.7 76.5,44.69 73.87,47.32 Q2.8 Q2.7 Q2.6 Q2.5 ; C5.2 56.12,39.36 R13.2 ; v1(64.18,39.61) 64.43,39.61 64.45,39.63 67.73,39.63 67.93,39.84 U6.5 67.93,41.29 67.8,41.41 67.8,42.89 67.93,43.02 v1(67.93,47.11)
  Bottom Layer w0.254: 86.85,42.92 82.09,42.92 81.32,43.68 81.32,67.15 BAT1.2 ; 86.85,42.92 89.8,42.92 Q2#2.8 Q2#2.7 Q2#2.6 Q2#2.5 97.2,41.35 104.18,34.37 v1(104.18,30.98) ; 86.85,42.92 87.62,42.15 R4#2.1 ; v1(57.7,39.36) 57.96,39.61 v1(64.18,39.61) ; v1(67.93,47.11) 69.51,47.11 v1(69.64,47.23)
B-: length 203.1
  Top Layer w0.254: U7#2.6 106.98,29.58 111.42,29.58 112.5,30.66 112.5,30.75 112.5,30.75 PROT.1 ; U7.6 61.51,42.09 61.51,46.36 Q5.1 60.3,48.7 v1(60.24,48.76)
  Bottom Layer w0.254: v1(60.24,48.76) 51.22,48.76 46.02,43.55 46.02,6.47 44.24,4.69 5.63,4.69 2.73,7.59 BAT2.1 ; BAT1.1 157.9,65.5 157.9,31.61 156.63,30.34 115.11,30.34 v1(114.6,30.85)
BAT_SENS: length 36.1
  Top Layer w0.254: 70.31,21.38 70.11,21.58 v1(68.75,21.58) ; U2#2.16 49.75,17.06 60.75,28.06 v1(66.72,28.06)
  Bottom Layer w0.254: v1(88.93,37.71) 88.93,39.91 R5#2.1 89.05,41.24 R4#2.2 ; v1(68.75,21.58) 68.75,26.03 v1(66.72,28.06)
BTN_1: length 51.5
  Top Layer w0.254: v1(103.93,5.32) 103.93,4.81 104.71,4.03 120.93,4.03 123.49,6.59 v1(123.49,12.31)
  Bottom Layer w0.254: KEY1.2 85.81,7.95 89.86,3.9 103.02,3.9 103.93,4.81 v1(103.93,5.32) ; v1(123.49,12.31) 123.89,11.9 U3#2.15
BTN_2: length 37.3
  Top Layer w0.254: KEY2.2 102.89,5.34 104.56,3.67 121.08,3.67 v1(124.25,6.85)
  Bottom Layer w0.254: 130.93,12.55 130.24,12.55 129.43,11.73 129.43,8.39 129.08,8.04 127.86,8.04 126.29,6.47 124.63,6.47 v1(124.25,6.85)
BTN_3: length 14.7
  Bottom Layer w0.254: U3#2.2 130.24,11.9 129.78,11.44 129.78,8.19 129.28,7.68 128.01,7.68 126.41,6.09 122.85,6.09 121.7,7.24 KEY3.2
BTN_4: length 11
  Bottom Layer w0.254: KEY4.2 138.31,10.15 133.52,10.15 132.42,11.25 U3#2.3
BTN_INP: length 89.4
  Top Layer w0.254: U2#3.15 90.49,35.91 91.61,34.79 95.04,34.79 96.44,33.39 v1(96.44,23.61)
  Bottom Layer w0.254: v1(96.44,23.61) 96.5,23.55 KEY1.3 99.62,12.95 100.88,14.21 102.35,14.21 102.36,14.23 106.31,14.23 106.96,13.58 114.77,13.58 KEY2.3 117.27,12.95 118.66,14.34 125.39,14.34 126.09,13.64 133.51,13.64 KEY3.3 137.07,12.95 138.86,11.17 151.23,11.17 KEY4.3
GPIO0: length 2.1
  Top Layer w0.254: U1#2.2 23.77,78.72 23.77,76.81 0.1
GPIO1: length 2.8
  Top Layer w0.254: U1#2.3 24.17,78.72 24.17,77.15 24.55,76.77 1.1
GPIO2: length 1.9
  Top Layer w0.254: 24.55,78.22 24.55,77.27 25.18,76.65 2.1
GPIO3: length 3
  Top Layer w0.254: 3.1 25.69,76.35 25.71,76.37 25.71,76.81 24.97,77.54 24.97,78.72 U1#2.5
GPIO4: length 2.3
  Top Layer w0.254: U1#2.6 25.35,77.78 26.32,76.81
GPIO26: length 1.3
  Top Layer w0.254: U1#2.38 24.95,87.07 26.1
JACK: length 72.1
  Top Layer w0.254: v1(101.58,35.99) 102.91,37.33 145.47,37.33 CN2.4
  Bottom Layer w0.254: CN1.4 CN2.4 ; v1(101.58,35.99) 98.98,38.6 97.39,38.6 v1(96.49,37.7)
LCD_BL: length 29.9
  Top Layer w0.254: v1(106.6,7.48) 111.17,7.48 112.18,6.47 v1(113.45,6.47)
  Bottom Layer w0.254: v1(106.6,7.48) 106.52,7.56 U4.1 ; R3.1 132.39,2.15 130.73,2.15 129.84,3.04 120.31,3.04 119.42,3.93 115.99,3.93 v1(113.45,6.47)
LCD_D4: length 12.2
  Bottom Layer w0.254: U4.4 107.21,10.08 107.67,9.62 107.67,7.73 107.11,7.16 107.11,5.07 111.02,1.16 H1.11
LCD_D5: length 15
  Bottom Layer w0.254: U4.5 107.21,10.73 108.03,9.91 108.03,7.58 107.46,7.02 107.46,5.22 110.02,2.65 112.56,2.65 H1.12
LCD_D6: length 15.2
  Bottom Layer w0.254: U4.6 107.21,11.38 108.38,10.2 108.38,8.76 115.98,1.16 H1.13
LCD_D7: length 18.1
  Bottom Layer w0.254: U4.7 107.21,12.03 108.74,10.5 108.74,8.9 114.79,2.85 117.45,2.85 H1.14
LCD_E: length 14.1
  Top Layer w0.254: H1.6 98.82,6.18 102.02,9.39 v1(104.44,9.39)
  Bottom Layer w0.254: U4.3 104.48,9.43 v1(104.44,9.39)
LCD_RS: length 18.2
  Bottom Layer w0.254: H1.4 93.74,1.87 95.42,3.55 103.17,3.55 104.95,5.32 104.95,8.5 105.23,8.78 U4.2
QSPI_SCLK: length 26.5
  Top Layer w0.254: v1(22.14,93.46) 21.32,94.29 21.32,94.77 20.94,95.14 20.94,95.14 20.8,95.28 20.46,95.28 U2.6 20.05,95.36 19.8,95.61 19.8,96.12 19.97,96.28 20.52,96.28 20.77,96.54 20.77,99.69 20.52,99.94 U3.6 ; v1(19.6,81.52) 19.84,81.29 U1#2.52
  Bottom Layer w0.254: v1(19.6,81.52) 18.92,82.21 18.92,83.09 20.39,84.56 20.39,91.71 v1(22.14,93.46)
QSPI_SD0: length 28.7
  Top Layer w0.254: v1(19.6,80.64) 19.85,80.89 U1#2.53 ; 20.86,95.86 21,95.86 v1(21.48,96.35) ; 20.86,95.86 U2.5 ; 20.86,95.86 21.13,96.13 21.13,100.7 20.62,101.21 U3.5
  Bottom Layer w0.254: v1(21.48,96.35) 21.48,93.9 20.03,92.45 20.03,84.71 18.56,83.24 18.56,81.68 v1(19.6,80.64)
QSPI_SD1: length 25.7
  Top Layer w0.254: v1(20.62,79.75) 20.96,80.09 U1#2.55 ; v1(23.41,93.34) 23.4,93.35 23.4,93.53 22.82,94.11 22.82,94.62 22.98,94.78 23.31,94.78 U2.2 23.73,94.86 24.33,95.46 24.33,96.27 23.96,96.64 23.45,96.64 22.85,97.23 22.85,98.16 23.36,98.67 U3.2
  Bottom Layer w0.254: v1(23.41,93.34) 23.41,92.09 22.88,91.56 22.88,82.01 v1(20.62,79.75)
QSPI_SD2: length 28.3
  Top Layer w0.254: v1(22.52,95.36) U2.3 23.73,95.36 23.97,95.61 23.97,96.12 23.81,96.28 23.3,96.28 22.5,97.08 22.5,99.18 23.06,99.73 23.7,99.73 23.91,99.94 U3.3 ; v1(19.73,79.87) 20.34,80.49 U1#2.54
  Bottom Layer w0.254: v1(19.73,79.87) 22.52,82.67 22.52,91.82 22.76,92.05 22.76,93.67 22.52,93.91 v1(22.52,95.36)
QSPI_SD3: length 24.2
  Top Layer w0.254: U3.7 20.11,98.67 20.42,98.36 20.42,96.78 20.27,96.64 19.82,96.64 19.45,96.27 19.45,95.46 20.04,94.86 U2.7 20.46,94.78 20.8,94.78 20.96,94.62 20.96,93.76 22.17,92.54 v1(22.17,92.35) ; v1(20.74,82.03) 21.09,81.69 U1#2.51
  Bottom Layer w0.254: v1(20.74,82.03) 20.66,82.12 19.61,82.12 19.27,82.46 19.27,82.94 20.74,84.42 20.74,90.54 22.17,91.97 v1(22.17,92.35)
QSPI_SS: length 24.5
  Top Layer w0.254: 23.72,94.35 23.87,94.51 23.88,94.51 24.69,95.31 24.69,96.41 24.66,96.44 U3.1 ; 23.72,94.35 25.39,94.35 R10.1 R11.2 ; 23.72,94.35 23.41,94.35 ; 23.41,94.35 24.3,93.46 v1(24.3,93.34) ; 23.41,94.35 U2.1 ; U1#2.56 21.7,79.69 v1(21.38,79.37)
  Bottom Layer w0.254: v1(24.3,93.34) 24.3,92.06 23.23,91 23.23,81.22 v1(21.38,79.37)
S_DS: length 50.3
  Top Layer w0.254: v1(126.66,11.55) 126.66,14.72 v1(123.87,17.52)
  Bottom Layer w0.254: v1(126.66,11.55) 126.37,11.25 U3#2.14 ; v1(97.99,37.7) 97.99,33.86 101.47,30.38 101.47,21.75 105.11,18.1 123.28,18.1 v1(123.87,17.52)
S_OUT: length 37.3
  Top Layer w0.254: v1(112.26,12.68) 112.26,14.16 118.28,20.18 v1(133.9,20.18)
  Bottom Layer w0.254: U9.5 140.89,22.34 138.73,20.18 v1(133.9,20.18)
S_SHCP: length 97.9
  Top Layer w0.254: v1(124.12,16.12) 126.08,14.16 126.08,11.31 126.66,10.72 v1(126.66,9.52) ; U9.4 138.35,21.83 134.79,18.28 122.09,18.28 118.66,14.85 v1(118.66,12.08) 120.19,10.55 v1(120.19,10.28)
  Bottom Layer w0.254: v1(94.99,37.7) 94.99,35.45 95.29,35.14 96.2,35.14 101.11,30.24 101.11,21.6 104.97,17.75 122.5,17.75 v1(124.12,16.12) ; v1(120.19,10.28) 122.73,10.28 123.7,9.3 U3#2.11 126.45,9.3 v1(126.66,9.52) ; 112.26,11.38 117.97,11.38 v1(118.66,12.08)
S_STCP: length 89.8
  Top Layer w0.254: v1(118.49,10.73) 117.77,11.45 117.77,15.23 v1(119.63,17.09) 121.84,19.29 134.41,19.29 135.81,20.69 U9.3
  Bottom Layer w0.254: 112.26,10.73 v1(118.49,10.73) 118.86,10.73 119.17,11.04 123.11,11.04 124.19,9.95 125.19,9.95 ; v1(87.49,37.7) 90.4,34.79 96.06,34.79 100.76,30.09 100.76,21.45 104.82,17.39 119.34,17.39 v1(119.63,17.09)
SPI_CS: length 158.8
  Top Layer w0.254: v1(28.24,84.7) 28.57,84.7 28.69,84.82 28.79,84.82 28.84,84.87 29.48,84.87 U1#2.28 ; v1(47.03,19.93) 47.03,19.36 45.58,17.91 45.58,5.64 43.54,3.6 19.4,3.6 RFID1.1 ; v1(59.48,19.93) 61.11,21.56 U2#2.6 ; v1(112.95,8.76) 112.95,10.78 110.32,13.41 110.32,15.44 109.63,16.13 106.3,16.13 100.48,21.95 100.48,39.25 99.25,40.48 94.68,40.48 91.97,43.19 91.97,65.67 RFID1#2.1
  Bottom Layer w0.254: 112.26,8.78 112.93,8.78 v1(112.95,8.76) ; RFID1#3.1 20.04,73.4 29.42,82.77 29.42,83.71 28.61,84.52 28.42,84.52 v1(28.24,84.7) ; v1(47.03,19.93) v1(59.48,19.93)
SPI_MISO: length 128.1
  Top Layer w0.254: U1#2.27 29.48,84.47 28.84,84.47 28.36,83.99 v1(28.36,83.94) ; RFID1.4 25.95,2.53 43.99,2.53 46.65,5.2 46.65,16.5 v1(47.03,16.88) ; RFID1#2.4 90.24,60.31 91.26,59.3 91.26,42.9 94.38,39.77 98.96,39.77 99.76,38.96 99.76,24.65 97.43,22.32 92.1,22.32 90.49,20.71 U2#3.4 ; v1(60.88,16.88) 62.55,18.56 U2#2.4
  Bottom Layer w0.254: v1(47.03,16.88) v1(60.88,16.88) ; RFID1#3.4 17.44,80.64 21,77.08 23.22,77.08 29.06,82.92 29.06,83.41 28.72,83.75 28.55,83.75 v1(28.36,83.94)
SPI_MOSI: length 140.8
  Top Layer w0.254: v1(28.55,86.86) 28.53,86.86 28.17,86.5 28.17,85.86 U1#2.30 ; v1(22.52,74.16) 21.63,75.05 v1(20.74,75.05) ; U2#2.5 62.4,20.06 v1(60.11,17.77) ; v1(47.03,17.77) 47.03,17.71 46.3,16.97 46.3,5.34 43.84,2.89 23.77,2.89 RFID1.3 ; U2#3.5 91.99,21.71 92.25,21.96 97.58,21.96 100.12,24.5 100.12,39.11 99.1,40.12 94.53,40.12 91.61,43.04 91.61,60.95 RFID1#2.3
  Bottom Layer w0.254: v1(20.74,75.05) 20.74,75.17 RFID1#3.3 ; v1(47.03,17.77) v1(60.11,17.77) ; v1(28.55,86.86) 28.55,86.92 29.07,87.44 29.56,87.44 30.13,86.87 30.13,81.77 v1(22.52,74.16)
SPI_SCK: length 147.5
  Top Layer w0.254: U2#3.3 88.99,21.5 90.16,22.67 97.29,22.67 99.41,24.8 99.41,38.81 98.81,39.41 94.24,39.41 90.9,42.75 90.9,58.74 90.37,59.27 88.83,59.27 88.67,59.44 88.67,64.35 RFID1#2.2 ; U1#2.29 29.31,86.6 v1(29.31,86.86) ; v1(59.35,18.53) 59.35,17.39 60.75,15.99 61.51,15.99 62.58,17.06 U2#2.3 ; v1(17.57,75.81) 19.41,73.97 v1(21.44,73.97) ; v1(47.03,18.53) 46.97,18.53 45.94,17.5 45.94,5.49 43.69,3.24 21.58,3.24 RFID1.2
  Bottom Layer w0.254: v1(47.03,18.53) v1(59.35,18.53) ; v1(21.44,73.97) 29.78,82.31 29.78,83.85 29.31,84.32 v1(29.31,86.86)
SWCLK: length 1.1
  Top Layer w0.254: 30.52,83.16 30.27,83.16 30.17,83.27 29.52,83.27 U1#2.24
SWD: length 1.1
  Top Layer w0.254: U1#2.25 30.22,83.69 30.28,83.74 30.33,83.74 30.52,83.94
USB_D+: length 65.9
  Top Layer w0.254: 62.02,54.72 61.78,54.96 61.25,54.96 61,54.71 61,54.14 USB1.8 ; 62.02,54.72 v1(62.02,55.49) ; 62.02,54.72 USB1.6 ; v1(85.9,49.76) 85.87,49.74 85.87,43.2 89.71,39.36 91.23,39.36 91.99,38.6 U2#3.14 ; v1(63.1,52.5) 63.1,31.3 52.24,20.44 48.95,20.44 U2#2.14
  Bottom Layer w0.254: v1(62.02,55.49) 63.04,54.47 63.04,52.57 v1(63.1,52.5) ; USB1#3.6 84.24,48.76 83.99,49.02 83.99,49.51 84.24,49.76 USB1#3.8 v1(85.9,49.76)
USB_D-: length 61.1
  Top Layer w0.254: 62.52,53.54 62.52,31.6 52.11,21.2 48.93,21.2 U2#2.13 ; 62.52,53.54 USB1.5 ; 62.52,53.54 62.28,53.3 61.75,53.3 61.59,53.46 61.59,54.06 USB1.7 ; U2#3.13 93.49,38.5 92.88,39.11 91.99,39.11 91.38,39.72 89.85,39.72 86.45,43.11 v1(86.45,48.26)
  Bottom Layer w0.254: 85.39,48.26 85.46,48.33 85.51,48.33 85.72,48.54 85.72,49.01 85.47,49.26 USB1#3.7 ; 85.39,48.26 v1(86.45,48.26) ; 85.39,48.26 USB1#3.5
USB_DM: length 4.5
  Top Layer w0.254: R2.2 16.89,83.04 USB1#2.5 14.92,82.97 14.33,82.97 14.14,82.78 14.14,82.29 14.39,82.04 USB1#2.7
USB_DP: length 3.7
  Top Layer w0.254: 15.82,82.08 16.12,81.78 R1.2 ; 15.82,82.08 15.82,81.77 15.59,81.54 USB1#2.8 ; 15.82,82.08 15.82,82.3 15.66,82.47 15.06,82.47 USB1#2.6
VUSB: length 143.2
  Top Layer w0.254: U5.3 10.44,70.27 10.46,70.29 ; C14.2 12.17,73.66 C15.2 10.46,70.29 ; 12.09,79.8 11.85,80.03 11.85,84.03 12.09,84.27 14.13,84.27 14.55,84.69 USB1#2.2 ; 12.09,79.8 12.09,77.44 10.46,75.81 10.46,70.29 ; 12.09,79.8 13.43,79.8 13.66,80.03 14.85,80.03 USB1#2.11 ; 69.26,40.25 70.02,41.01 72.62,41.01 73.74,39.89 ; 69.26,40.25 69.26,36.69 68.64,36.08 68.1,36.08 ; 69.26,40.25 69.26,41.48 LED2.2 68.58,48.18 R7.1 66.59,50.17 66.59,52.19 68.85,54.45 D2.2 65.45,57.01 64.05,55.62 ; TP_VUSB.1 87.39,51.8 v1(86.71,51.12) ; LED1.1 68.53,35.64 68.1,36.08 ; 64.05,55.62 64.05,58.41 63.8,58.66 59.35,58.66 59.17,58.48 59.17,55.79 59.5,55.46 59.5,54.27 USB1.11 ; 64.05,55.62 64.03,55.59 64.03,54.94 64.17,54.8 USB1.2 ; 68.1,36.08 U6.8
  Bottom Layer w0.254: 87.04,50.79 v1(86.71,51.12) ; 87.04,50.79 87.04,47.23 86.42,46.61 USB1#3.2 ; 87.04,50.79 89.2,48.63 89.2,45.96 90.45,44.71 R7#2.1 97.07,42.28 106.55,32.8 LED2#2.2 106.55,23.28 LED1#2.1 107.14,22.6 v1(107.99,22.6) 109.14,22.6 112.95,26.41 v1(113.84,26.41) ; v1(86.71,51.12) 90.39,54.79 D2#2.2 ; v1(86.71,51.12) 86.42,51.41 USB1#3.11
XIN: length 10.5
  Top Layer w0.254: 29.63,81.71 30.62,81.71 31.56,82.65 31.56,86.15 30.26,87.45 30.26,88.89 X1.1
XOUT: length 8.3
  Top Layer w0.254: X1.3 31.21,86 31.21,82.79 30.52,82.11 29.52,82.11 U1#2.21
$1N383: length 2
  Bottom Layer w0.254: R1#3.1 94.84,30.31 U1#3.3
$1N405: length 4.8
  Top Layer w0.254: U2#2.2 66.49,15.98 R2#2.2 70.23,15.98 C3.2
$1N953: length 2.1
  Bottom Layer w0.254: R2#3.2 87.79,21.79 C3#3.2
  vias: v1(87.49,20.2)
$1N1062: length 5.2
  Top Layer w0.254: R1.1 18.07,81.78 19.58,83.29 U1#2.47
$1N1071: length 4.5
  Top Layer w0.254: R1#2.1 48.5,34.58 U1.3
$1N1101: length 4.8
  Top Layer w0.254: R2.1 18.71,82.92 19.47,83.68 22.4,83.68 U1#2.46
$1N1888: length 2.6
  Top Layer w0.254: USB1#2.4 14.97,83.56 14.01,83.56 13.51,83.05 R8#2.2
$1N1892: length 2.6
  Top Layer w0.254: R9#2.2 13.51,81.02 14.01,80.51 14.96,80.51 USB1#2.10
$1N2947: length 21.2
  Top Layer w0.254: 26.38,95.62 v1(26.38,96.64)
  Bottom Layer w0.254: v1(26.38,96.64) 26.38,101.68 25.7,102.36 13.52,102.36 H1#2.2
$1N7305: length 13.5
  Bottom Layer w0.254: U3#2.9 123.98,8 122.56,9.43 112.26,9.43
$2N1363: length 33.4
  Top Layer w0.254: D2.1 73.32,56.35 73.32,52.73 Q2.2 70.78,52.73 ; H4.2 51.48,46.47 55.16,50.16 v1(61.64,50.16)
  Bottom Layer w0.254: v1(61.64,50.16) 68.37,50.16 v1(70.91,52.7)
$2N1368: length 2.6
  Top Layer w0.254: Q2.4 69.44,52.73 R7.2
$2N1375: length 4
  Top Layer w0.254: R14.2 56.94,42.92 57.83,42.03 58.84,42.03 59.35,42.53 U7.2
$2N1376: length 1.7
  Top Layer w0.254: Q5.4 U7.3
$2N1379: length 1.7
  Top Layer w0.254: U7.1 Q5.6
$2N1382: length 1.6
  Top Layer w0.254: R13.1 59.22,40.74 U7.5
$2N1388: length 3.8
  Top Layer w0.254: USB1.4 v1(63.02,57.9)
$2N1391: length 3.8
  Top Layer w0.254: USB1.10 60.02,57.8 v1(60.11,57.9)
$2N1394: length 1.7
  Top Layer w0.254: U6.7 66.62,37.35 R11#2.2
$2N1395: length 1.7
  Top Layer w0.254: U6.6 67.69,38.86 R12.2
$2N1399: length 1.7
  Top Layer w0.254: R10#2.1 75.22,37.35 73.74,37.35
$2N1401: length 1.8
  Top Layer w0.254: 66.38,42.15 66.34,42.11 R12.1
$2N1402: length 2
  Top Layer w0.254: R11#2.1 66.43,35.47 LED1.2
$2N3153: length 2.1
  Bottom Layer w0.254: R3.2 131.27,3.28 Q1.1
$2N3159: length 5.5
  Bottom Layer w0.254: H1.16 128.1,1.16 Q1.3
$3N541: length 45.9
  Bottom Layer w0.254: Q2#2.1 Q2#2.2 Q2#2.3 93.9,47.75 D4.1 98.47,48.35 98.47,41.65 104.31,35.8 SW.2
$3N542: length 1.9
  Bottom Layer w0.254: R7#2.2 97.02,46.76 Q2#2.4
$3N546: length 3.1
  Bottom Layer w0.254: D3.2 93.32,50.33 D2#2.1
$3N547: length 3.1
  Bottom Layer w0.254: D3.1 93.52,55.47 D4.2
$3N796: length 2.8
  Bottom Layer w0.254: v1(82.09,50.79) 84.81,50.79 USB1#3.10
$3N800: length 2.8
  Bottom Layer w0.254: USB1#3.4 v1(82.09,47.76)
$3N1470: length 2
  Top Layer w0.254: R13#2.1 104.23,32.46 104.98,31.7 U7#2.5
$3N1480: length 2.2
  Top Layer w0.254: U6#2.7 107.8,23.61 106.08,23.61 105.95,23.74
$3N1483: length 2.2
  Top Layer w0.254: R12#2.2 107.79,25.39 U6#2.6
$3N1491: length 1.8
  Top Layer w0.254: R10#3.1 115.55,23.86 U6#2.2
$3N1585: length 3.5
  Top Layer w0.254: U7#2.2 107.99,31.81 107.41,31.81 106.97,32.26 R14#2.2
$3N1604: length 1.7
  Top Layer w0.254: Q5#2.4 U7#2.3
$3N1608: length 1.7
  Top Layer w0.254: U7#2.1 Q5#2.6
$3N3082:
  vias: v1(104.4,23.61)
$3N3173:
  vias: v1(104.45,25.39)

## Copper pours and planes (outline as drawn; the poured copper is in the pictures)
GND on Bottom Layer: 84.92,0 153.17,0 158.53,5.36 158.53,33.27 157.14,34.66 105.45,34.66 102.91,32.12 102.91,20.38 84.92,2.39
